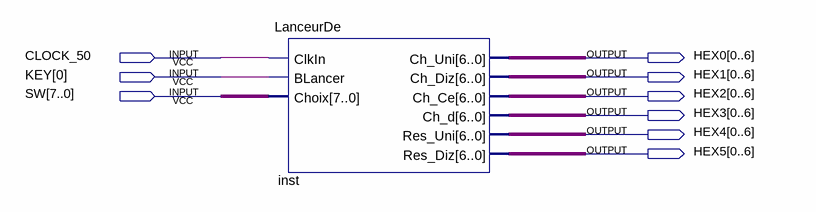
[diagram p0: schematic sheet]
// Quartus schematic BlockLanceur.bdf as structural Verilog: 1 symbols, 9 pins
module BlockLanceur (
  input  CLOCK_50,
  input  [0:0] KEY,
  input  [7:0] SW,
  output [0:6] HEX0,
  output [0:6] HEX1,
  output [0:6] HEX2,
  output [0:6] HEX3,
  output [0:6] HEX4,
  output [0:6] HEX5
);

  LanceurDe inst (
    .ClkIn(CLOCK_50), .BLancer(KEY[0]), .Choix(SW), .Ch_Uni(HEX0), .Ch_Diz(HEX1), .Ch_Ce(HEX2), .Ch_d(HEX3),
    .Res_Uni(HEX4), .Res_Diz(HEX5));
endmodule
